# Altium schematic sheet 05-GIGE PORT.SchDoc
size 513 x 386 mm
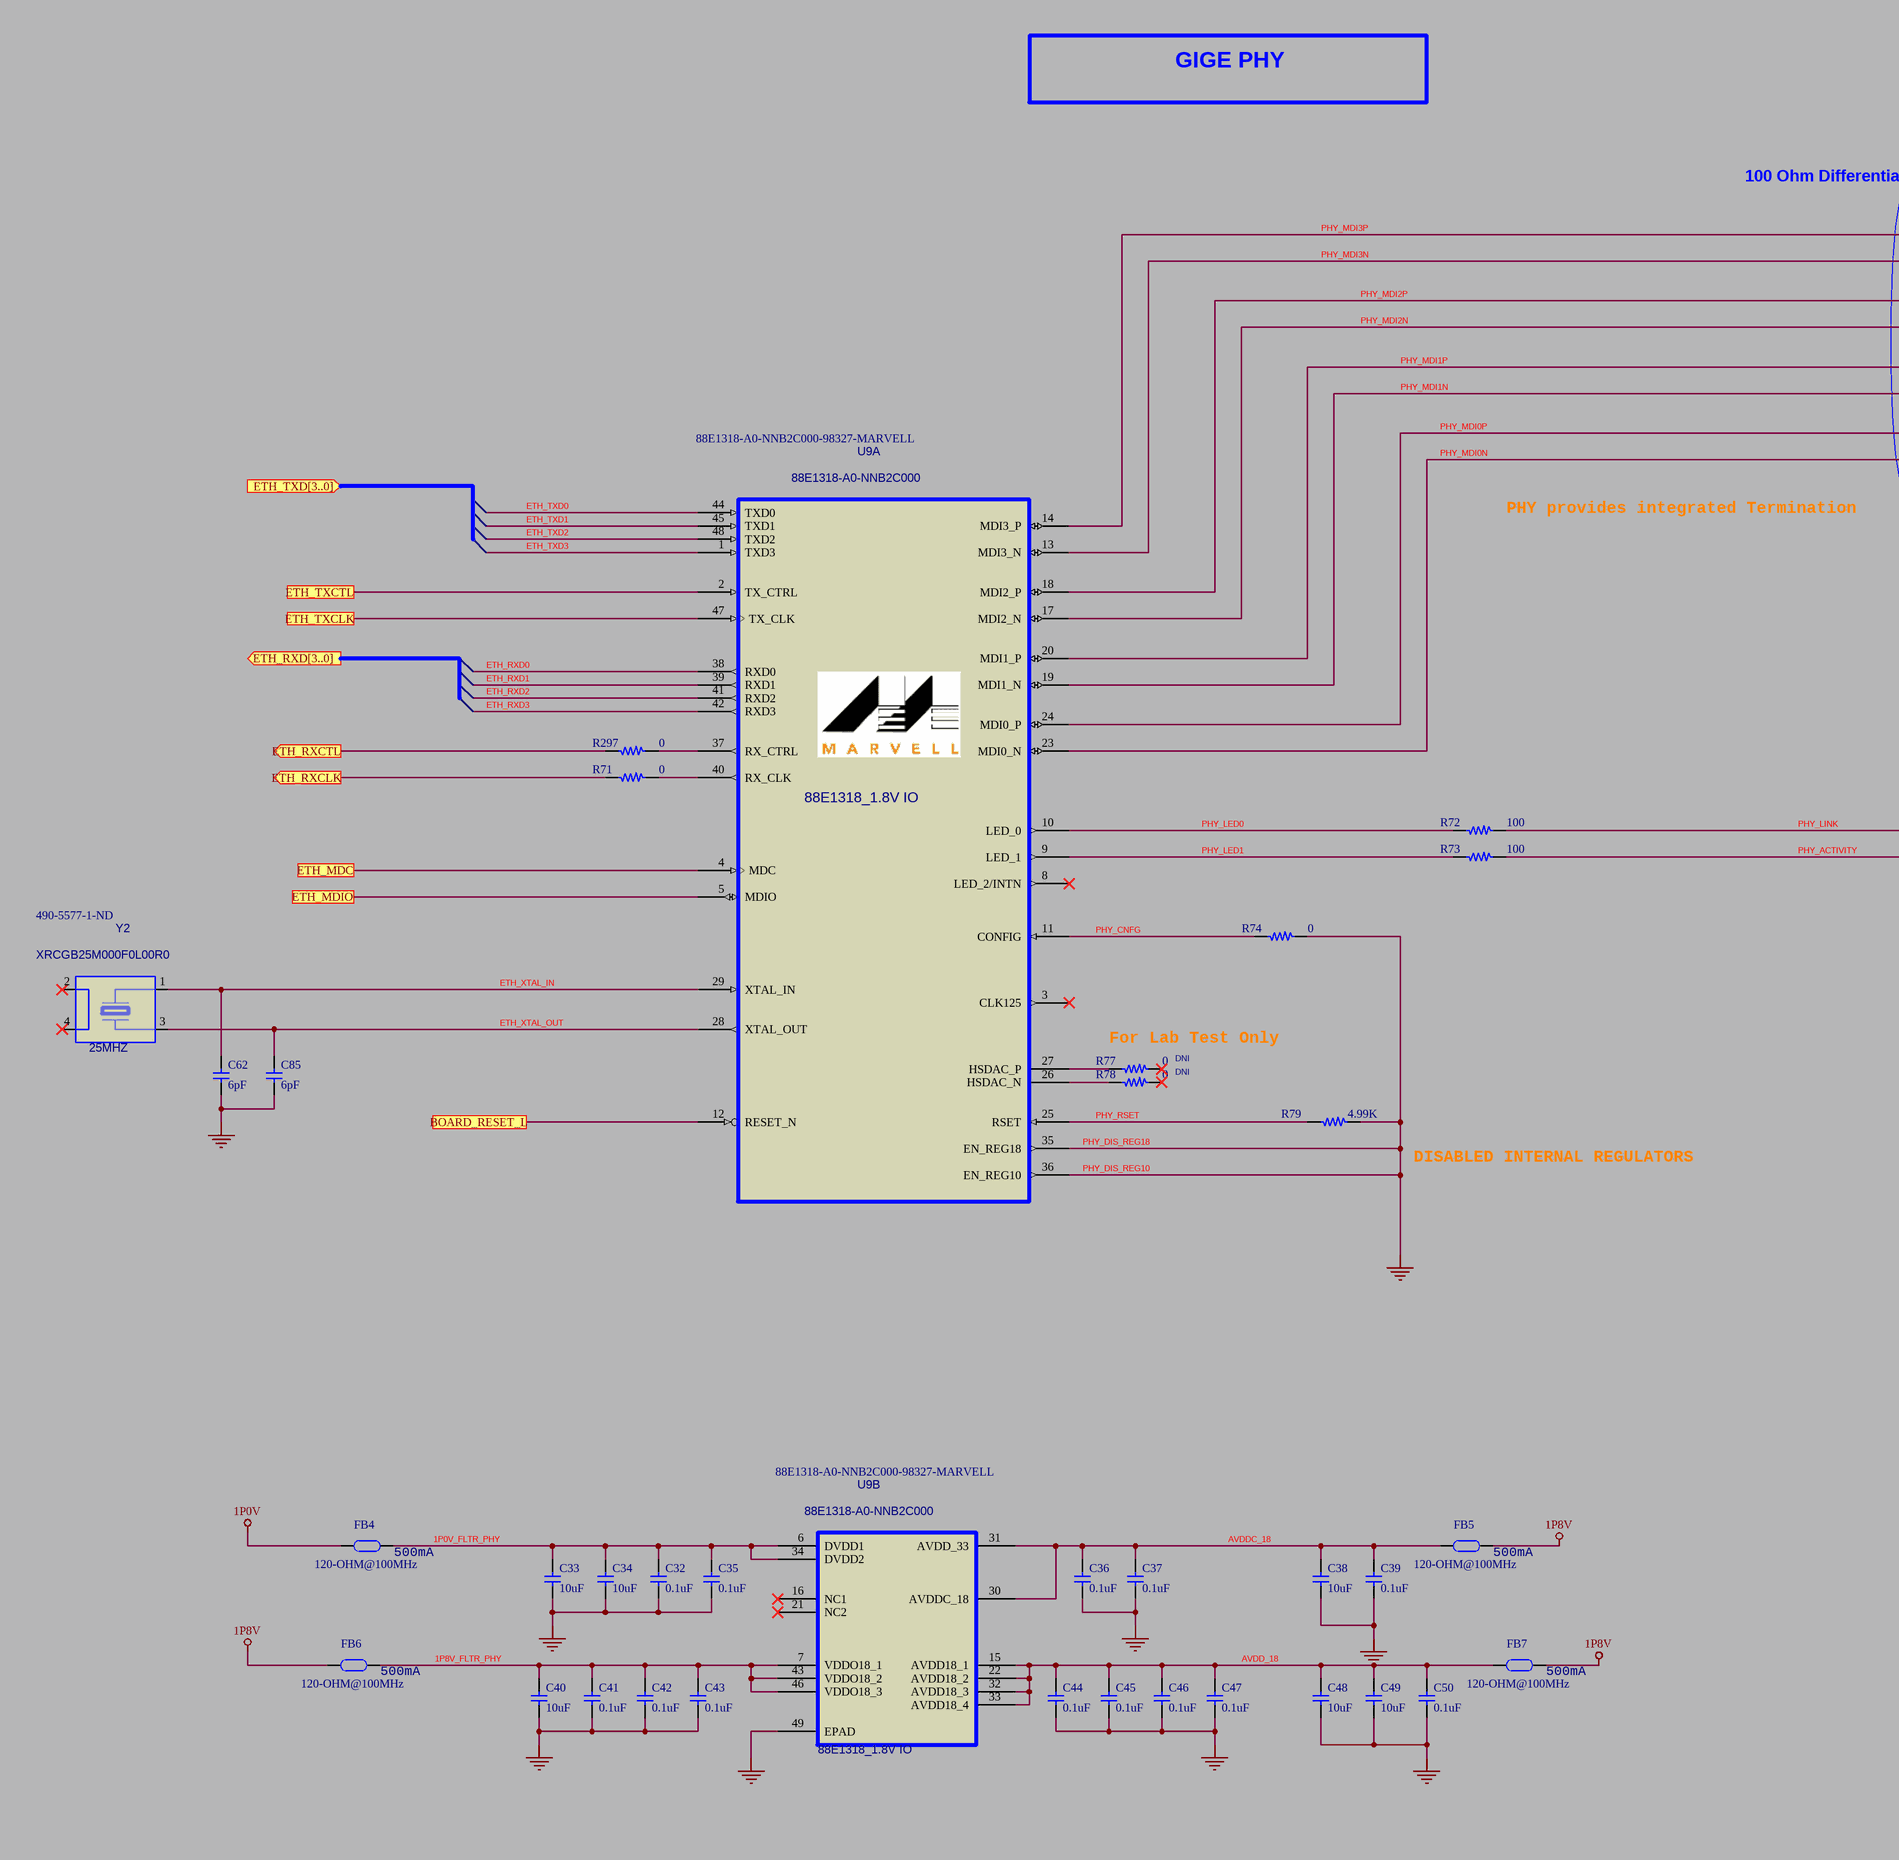
[diagram p0: 05-GIGE PORT.SchDoc, left]
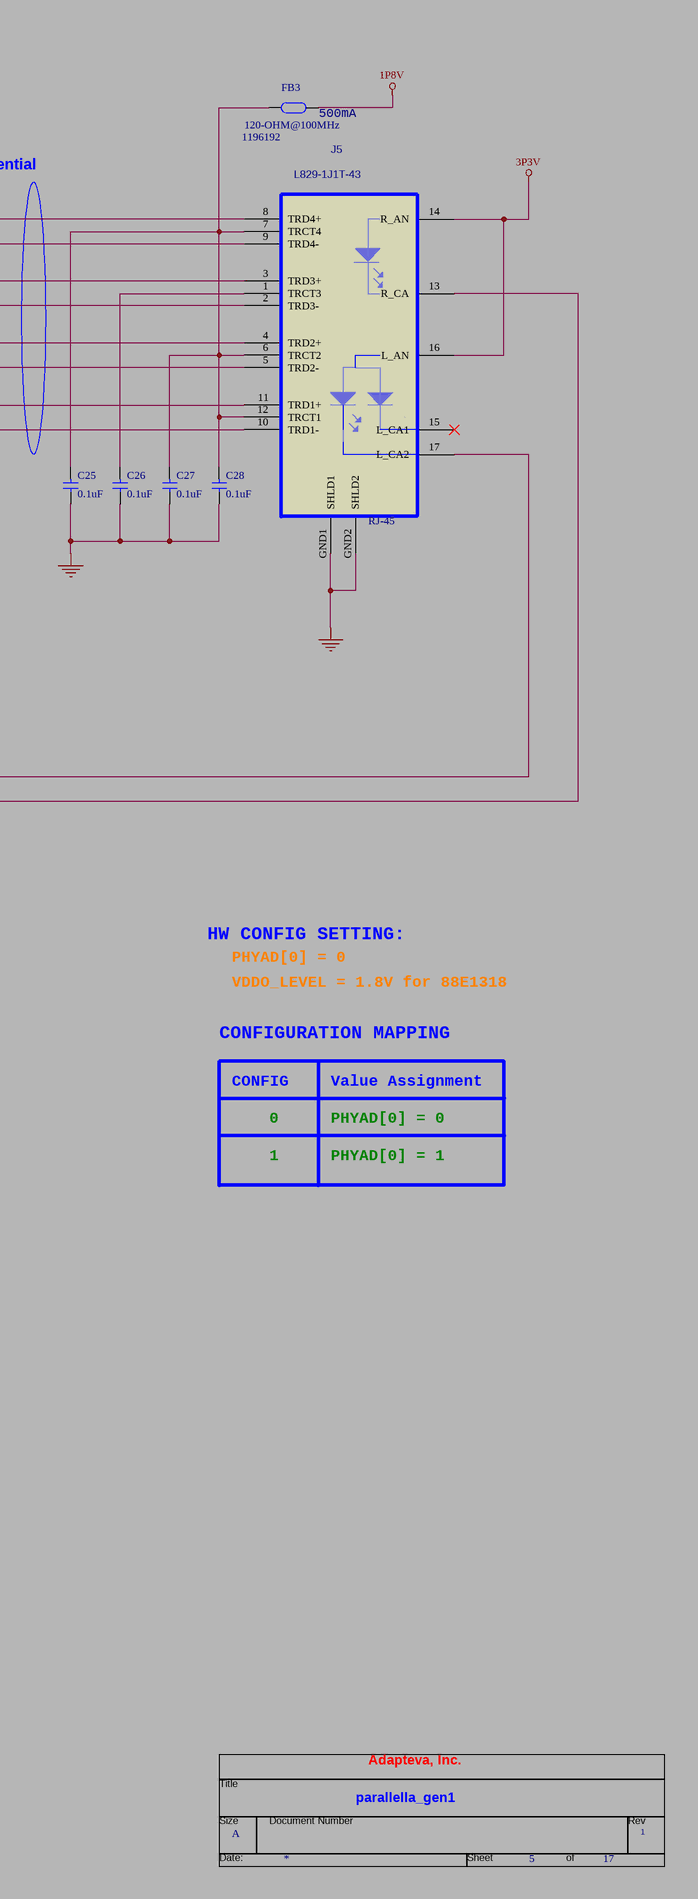
[diagram p1: 05-GIGE PORT.SchDoc, right]

## Parts
*  RevCode: 1  Title: parallella_gen1  Page Size: A  Page Number: 5  Page Count: 17  OrgAddr1: Adapteva, Inc.  (hidden comment: TitleBlock0)  (graphical)
C25  0.1uF  [C0402]
C26  0.1uF  [C0402]
C27  0.1uF  [C0402]
C28  0.1uF  [C0402]
C32  0.1uF  [C0402]
C33  10uF  [C0603]
C34  10uF  [C0603]
C35  0.1uF  [C0402]
C36  0.1uF  [C0402]
C37  0.1uF  [C0402]
C38  10uF  [C0603]
C39  0.1uF  [C0402]
C40  10uF  [C0603]
C41  0.1uF  [C0402]
C42  0.1uF  [C0402]
C43  0.1uF  [C0402]
C44  0.1uF  [C0402]
C45  0.1uF  [C0402]
C46  0.1uF  [C0402]
C47  0.1uF  [C0402]
C48  10uF  [C0603]
C49  10uF  [C0603]
C50  0.1uF  [C0402]
C62  6pF  [C0402]
C85  6pF  [C0402]
FB3  120-OHM@100MHz  [FBEAD_0402]
FB4  120-OHM@100MHz  [FBEAD_0402]
FB5  120-OHM@100MHz  [FBEAD_0402]
FB6  120-OHM@100MHz  [FBEAD_0402]
FB7  120-OHM@100MHz  [FBEAD_0402]
J5  RJ-45  MFG PART NO: L829-1J1T-43  Supplier Part Number 1: 1196192  [RJ45_17PINS_2LED]
R71  0  [R0402]
R72  100  [R0402]
R73  100  [R0402]
R74  0  [R0402]
R77  0  INSTALL: DNI  [R0402]
R78  0  INSTALL: DNI  [R0402]
R79  4.99K  [R0402]
R297  0  [R0402]
U9  88E1318_1.8V IO  Vendor PN: 88E1318-A0-NNB2C000  Supplier Part Number 1: 88E1318-A0-NNB2C000-98327-MARVELL  [QFN48_7SQXP5PX1MMH_3P1PAD]  (parts A,B of 2)
Y2  25MHZ  Vendor PN: XRCGB25M000F0L00R0  Supplier Part Number 1: 490-5577-1-ND  [OSC4_1P6X2X7MMH]

## Ports
BOARD_RESET_L, ETH_MDC, ETH_MDIO, ETH_RXCLK (out), ETH_RXCTL (out), ETH_RXD[3..0] (out), ETH_TXCLK, ETH_TXCTL, ETH_TXD[3..0] (in)

## Nets
1P0V: FB4.1
1P8V: FB3.2 FB5.2 FB6.1 FB7.2
3P3V: J5.14(R_AN) J5.16(L_AN)
PHY_DIS_REG10: C25.2 C26.2 C27.2 C28.2 C32.2 C33.2 C34.2 C35.2 C36.2 C37.2 C38.2 C39.2 C40.2 C41.2 C42.2 C43.2 C44.2 C45.2 C46.2 C47.2 C48.2 C49.2 C50.2 C62.2 C85.2 J5.GND1(SHLD1) J5.GND2(SHLD2) R74.2 R79.2 U9.35(EN_REG18) U9.36(EN_REG10) U9.49(EPAD)  [also labelled GND, PHY_DIS_REG18]
1P0V_FLTR_PHY: C32.1 C33.1 C34.1 C35.1 FB4.2 U9.6(DVDD1) U9.34(DVDD2)
1P8V_FLTR_PHY: C40.1 C41.1 C42.1 C43.1 FB6.2 U9.7(VDDO18_1) U9.43(VDDO18_2) U9.46(VDDO18_3)
AVDD_18: C44.1 C45.1 C46.1 C47.1 C48.1 C49.1 C50.1 FB7.1 U9.15(AVDD18_1) U9.22(AVDD18_2) U9.32(AVDD18_3) U9.33(AVDD18_4)
AVDDC_18: C36.1 C37.1 C38.1 C39.1 FB5.1 U9.30(AVDDC_18) U9.31(AVDD_33)
BOARD_RESET_L: U9.12(RESET_N) ; port BOARD_RESET_L
ETH_MDC: U9.4(MDC) ; port ETH_MDC
ETH_MDIO: U9.5(MDIO) ; port ETH_MDIO
ETH_RXCLK: R71.1 ; port ETH_RXCLK
ETH_RXCTL: R297.1 ; port ETH_RXCTL
ETH_RXD0: U9.38(RXD0)
ETH_RXD1: U9.39(RXD1)
ETH_RXD2: U9.41(RXD2)
ETH_RXD3: U9.42(RXD3)
ETH_TXCLK: U9.47(TX_CLK) ; port ETH_TXCLK
ETH_TXCTL: U9.2(TX_CTRL) ; port ETH_TXCTL
ETH_TXD0: U9.44(TXD0)
ETH_TXD1: U9.45(TXD1)
ETH_TXD2: U9.48(TXD2)
ETH_TXD3: U9.1(TXD3)
ETH_XTAL_IN: C62.1 U9.29(XTAL_IN) Y2.1
ETH_XTAL_OUT: C85.1 U9.28(XTAL_OUT) Y2.3
PHY_ACTIVITY: J5.13(R_CA) R73.2
PHY_CNFG: R74.1 U9.11(CONFIG)
PHY_LED0: R72.1 U9.10(LED_0)
PHY_LED1: R73.1 U9.9(LED_1)
PHY_LINK: J5.17(L_CA2) R72.2
PHY_MDI0N: J5.10(TRD1-) U9.23(MDI0_N)
PHY_MDI0P: J5.11(TRD1+) U9.24(MDI0_P)
PHY_MDI1N: J5.5(TRD2-) U9.19(MDI1_N)
PHY_MDI1P: J5.4(TRD2+) U9.20(MDI1_P)
PHY_MDI2N: J5.2(TRD3-) U9.17(MDI2_N)
PHY_MDI2P: J5.3(TRD3+) U9.18(MDI2_P)
PHY_MDI3N: J5.9(TRD4-) U9.13(MDI3_N)
PHY_MDI3P: J5.8(TRD4+) U9.14(MDI3_P)
PHY_RSET: R79.1 U9.25(RSET)
NetC25_1: C25.1 C27.1 C28.1 FB3.1 J5.6(TRCT2) J5.7(TRCT4) J5.12(TRCT1)
NetC26_1: C26.1 J5.1(TRCT3)
NetR71_2: R71.2 U9.40(RX_CLK)
NetR77_1: R77.1 U9.27(HSDAC_P)
NetR78_1: R78.1 U9.26(HSDAC_N)
NetR297_2: R297.2 U9.37(RX_CTRL)

Not connected (* = marked no-connect by the designer): J5 15(L_CA1)*; R77 2*; R78 2*; U9 3(CLK125)* 8(LED_2/INTN)* 16(NC1)* 21(NC2)*; Y2 2* 4*

## Notes on the sheet
- GIGE PHY
- 100 Ohm Differential
- PHY provides integrated Termination
- For Lab Test Only
- HW CONFIG SETTING:
- PHYAD[0] = 0
- VDDO_LEVEL = 1.8V for 88E1318
- DISABLED INTERNAL REGULATORS
- CONFIGURATION MAPPING
- CONFIG
- Value Assignment
- 0
- 1
- PHYAD[0] = 1
- (in symbol BLM15AG121SN1D) 500mA
- (in symbol TitleBlock0) Title; Size; Document Number; Rev; Date:; Sheet; of

## Library data of the parts
C25-C28 C32 C35-C37 C39 C41-C47 C50 = CAP0402_0P1UF_X5R_35V: CAP, 0402, 0.1UF, X5R, 35V; ALT_SYMBOLS: C0402_BGA; Vendor PN: GMK105BJ104KV-F; Vendor: TAIYO YUDEN; DEVICE: CAP0402_0P1UF_X5R_35V; MFG PART NO: GMK105BJ104KV-F; MFG: TAIYO YUDEN; PCB Footprint: C0402
C33 C34 C38 C40 C48 C49 = CAP0603_10UF_X5R: CAP, 0603, 10UF, X5R, 10V; MFG PART NO: LMK107BJ106MALTD; MFG: TAIYO YUDEN; DEVICE: CAP0603_10UF_X5R; Vendor: TAIYO YUDEN; Vendor PN: LMK107BJ106MALTD; PCB Footprint: C0603
C62 C85 = CAP0402_6PF_NPO_50V: CAP, 0402, 6PF, NPO, 50V; ALT_SYMBOLS: C0402_BGA; Vendor PN: C1005COG1H060D050BA; Vendor: TDK; DEVICE: CAP0402_6PF_NPO_50V; MFG PART NO: C1005COG1H060D050BA; MFG: TDK; PCB Footprint: C0402
FB3-FB7 = BLM15AG121SN1D: FERRITE, BEAD, 0402, 120 OHM@ 100MHZ, 500mA, SMT; Vendor: MURATA; Vendor PN: BLM15AG121SN1D; DEVICE: BLM15AG121SN1D; MFG: MURATA; MFG PART NO: BLM15AG121SN1D; PCB Footprint: FBEAD_0402
J5 = RJ45-10_100_1000-BELFUSE: RJ45 JACK, INTEGRATED MAG AND LED; Vendor PN: L829-1J1T-43; Vendor: BEL FUSE; DEVICE: RJ45-10_100_1000-BELFUSE; MFG: BEL FUSE; PCB Footprint: RJ45_17PINS_2LED; Supplier 1: Conrad
R71 R74 R77 R78 R297 = RES0402_0: RES, 0402, 0 OHM, 1%; MFG PART NO: CRCW04020000Z0ED; ALT_SYMBOLS: R0402_BGA; MFG: VISHAY; Vendor: VISHAY/DALE; DEVICE: RES0402_0; Vendor PN: CRCW04020000Z0ED; PCB Footprint: R0402
R72 R73 = RES0402_100: RES, 0402, 100, 1%; ALT_SYMBOLS: R0402_BGA; Vendor PN: CRCW0402100RFKED; Vendor: VISHAY/DALE; MFG: VISHAY; MFG PART NO: CRCW0402100RFKED; DEVICE: RES0402_100; PCB Footprint: R0402
R79 = RES0402_4K99: RES, 0402, 4.99K, 1%; Vendor PN: CRCW04024K99FKED; Vendor: VISHAY/DALE; MFG: VISHAY; ALT_SYMBOLS: R0402_BGA; MFG PART NO: CRCW04024K99FKED; DEVICE: RES0402_4K99; PCB Footprint: R0402
U9 = 88E1318_QFN48: IC, GIGE PHY, QFN48; Vendor: MARVELL; DEVICE: 88E1318_QFN48; PCB Footprint: QFN48_7SQXP5PX1MMH_3P1PAD; Supplier 1: Bison Technologies
Y2 = XTAL_4P_25MHZ: XTAL, 2X1.6MM, 25MHZ, 4PIN, SMT; Vendor: MURATA; DEVICE: XTAL_4P_25MHZ; PCB Footprint: OSC4_1P6X2X7MMH; Supplier 1: Digi-Key
* = TitleBlock0: Page Create Date: March  8, 1995; Page Modify Date: *